# EAGLE design H2AR32 (EAGLE 9.6.2)

## Sheet 1 of 2
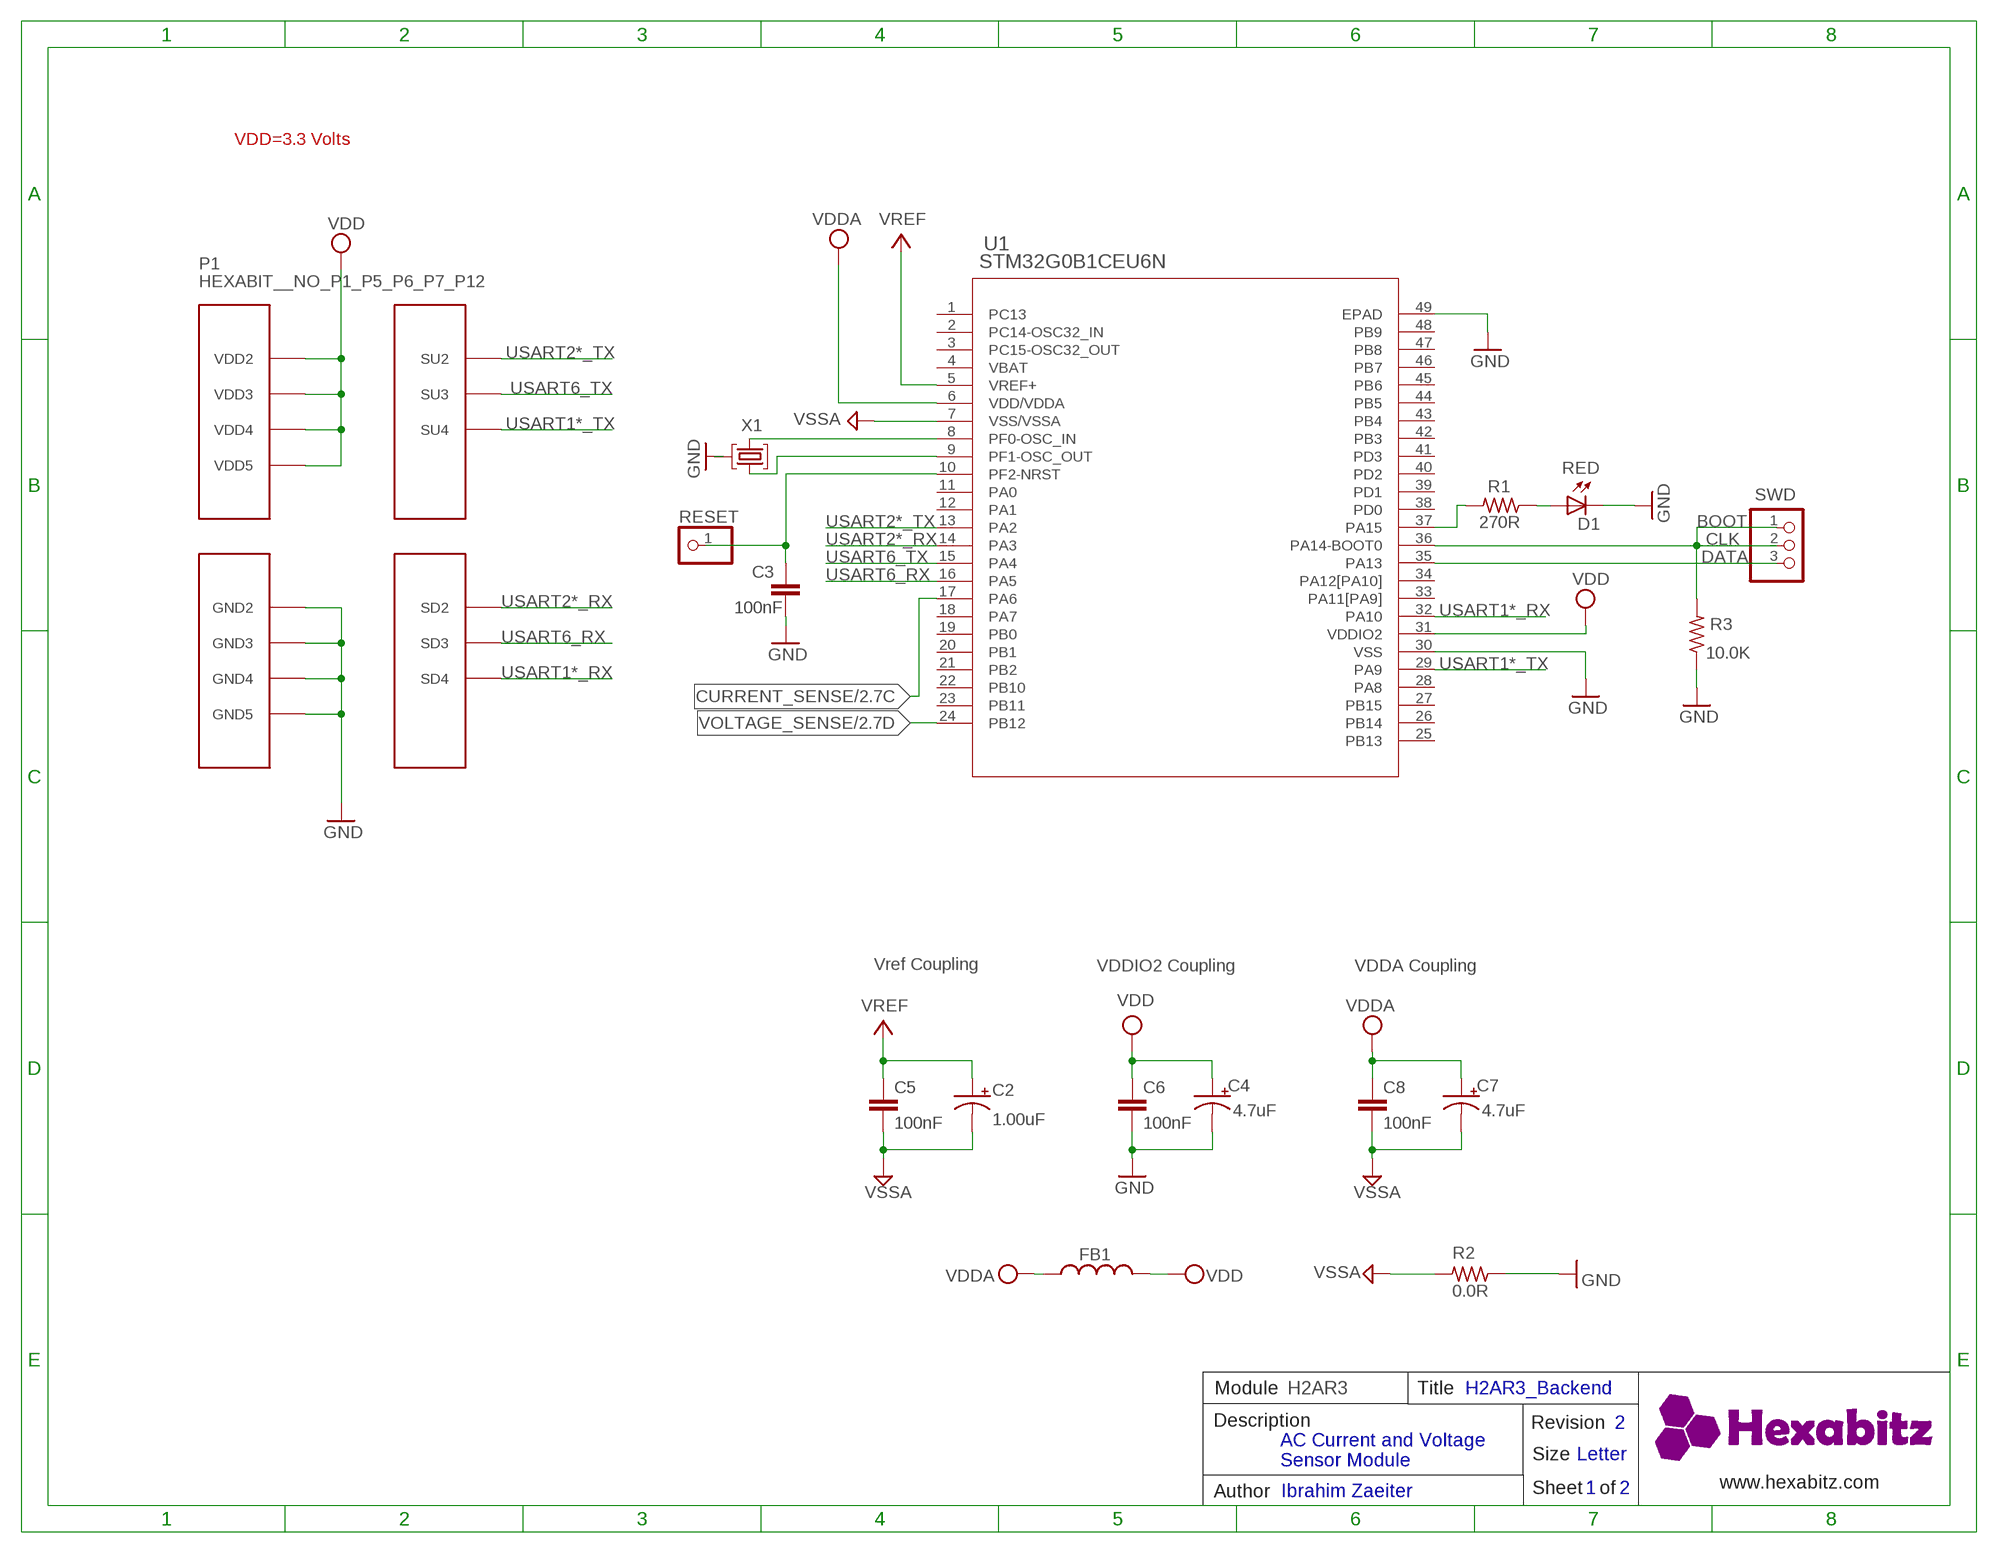
[diagram p0: schematic, sheet 1]

### Parts
C2  1.00uF  C-0805-POL  [C-0805-POL]
C3  100nF  C-0603  [C-0603]
C4  4.7uF  C-0805-POL  [C-0805-POL]
C5  100nF  C-0603  [C-0603]
C6  100nF  C-0603  [C-0603]
C7  4.7uF  C-0805-POL  [C-0805-POL]
C8  100nF  C-0603  [C-0603]
D1  RED  VLMS1300-GS08  [VLMS1300-GS08]
FB1  FB-TDK_MMZ1608Y300B  [FB-TDK_MMZ1608Y300B]
P1  HEXABIT__NO_P1_P5_P6_P7_P12  [HEXABIT_17.32_NO_P1_P6_P5_P7_P12]
R1  270R  R-0603  [R-0603]
R2  0.0R  R-0603  [R-0603]
R3  10.0K  R-0603  [R-0603]
RESET  R  PINHD-1X1  [1X01]
SWD  PINHD-1X3  [1X03]
U1  STM32G0B1CEU6N  [HEXABITZ_ICS_QFN_B1CEU6_STM-L]
X1  XTALL_CSTCE8M00G52  [XTALL_CSTCE8M00G52]

### Nets
CLK: R3.2 SWD.1 SWD.2 U1.36(PA14-BOOT0)
CURRENT_SENSE: U1.17(PA6) ; also sheet 2
DATA: SWD.3 U1.35(PA13)
GND: C3.2 C4.2(-) C6.2 D1.C P1.PAD_PD8(GND2) P1.PAD_PD9(GND3) P1.PAD_PD10(GND4) P1.PAD_PD11(GND5) R2.1 R3.1 U1.30(VSS) U1.49(EPAD) X1.P$2
N$1: R1.2 U1.37(PA15)
N$24: D1.A R1.1
N$25: U1.8(PF0-OSC_IN) X1.P$1
N$26: U1.9(PF1-OSC_OUT) X1.P$3
N$27: C3.1 RESET.1 U1.10(PF2-NRST)
USART1*_RX: P1.PAD_PD4(SD4) U1.32(PA10)
USART1*_TX: P1.PAD_PU4(SU4) U1.29(PA9)
USART2*_RX: P1.PAD_PD2(SD2) U1.14(PA3)
USART2*_TX: P1.PAD_PU2(SU2) U1.13(PA2)
USART6_RX: P1.PAD_PD3(SD3) U1.16(PA5)
USART6_TX: P1.PAD_PU3(SU3) U1.15(PA4)
VDD: C4.1(+) C6.1 FB1.2 P1.PAD_PU8(VDD2) P1.PAD_PU9(VDD3) P1.PAD_PU10(VDD4) P1.PAD_PU11(VDD5) U1.31(VDDIO2)
VDDA: C7.1(+) C8.1 FB1.1 U1.6(VDD/VDDA) ; also sheet 2
VOLTAGE_SENSE: U1.24(PB12) ; also sheet 2
VREF: C2.1(+) C5.1 U1.5(VREF+) ; also sheet 2
VSSA: C2.2(-) C5.2 C7.2(-) C8.2 R2.2 U1.7(VSS/VSSA) ; also sheet 2
Unconnected: U1.1(PC13) U1.2(PC14-OSC32_IN) U1.3(PC15-OSC32_OUT) U1.11(PA0) U1.12(PA1) U1.18(PA7) U1.19(PB0) U1.20(PB1) U1.21(PB2) U1.22(PB10) U1.23(PB11) U1.25(PB13) U1.26(PB14) U1.27(PB15) U1.28(PA8) U1.33(PA11[PA9]) U1.34(PA12[PA10]) U1.38(PD0) U1.39(PD1) U1.40(PD2) U1.41(PD3) U1.42(PB3) U1.43(PB4) U1.44(PB5) U1.45(PB6) U1.46(PB7) U1.47(PB8) U1.48(PB9)

### Notes on the sheet
- VDD=3.3 Volts
- BOOT
- Vref Coupling | VDDIO2 Coupling | VDDA Coupling
- Module | H2AR3 | Title | H2AR3_Backend
- Description | Revision | 2
- Size | Letter
- AC Current and Voltage 
  Sensor Module
- www.hexabitz.com
- Author | Ibrahim Zaeiter | Sheet   of | 1 | 2
- C:/Users/Admin/Desktop/logodraft.bmp

## Sheet 2 of 2
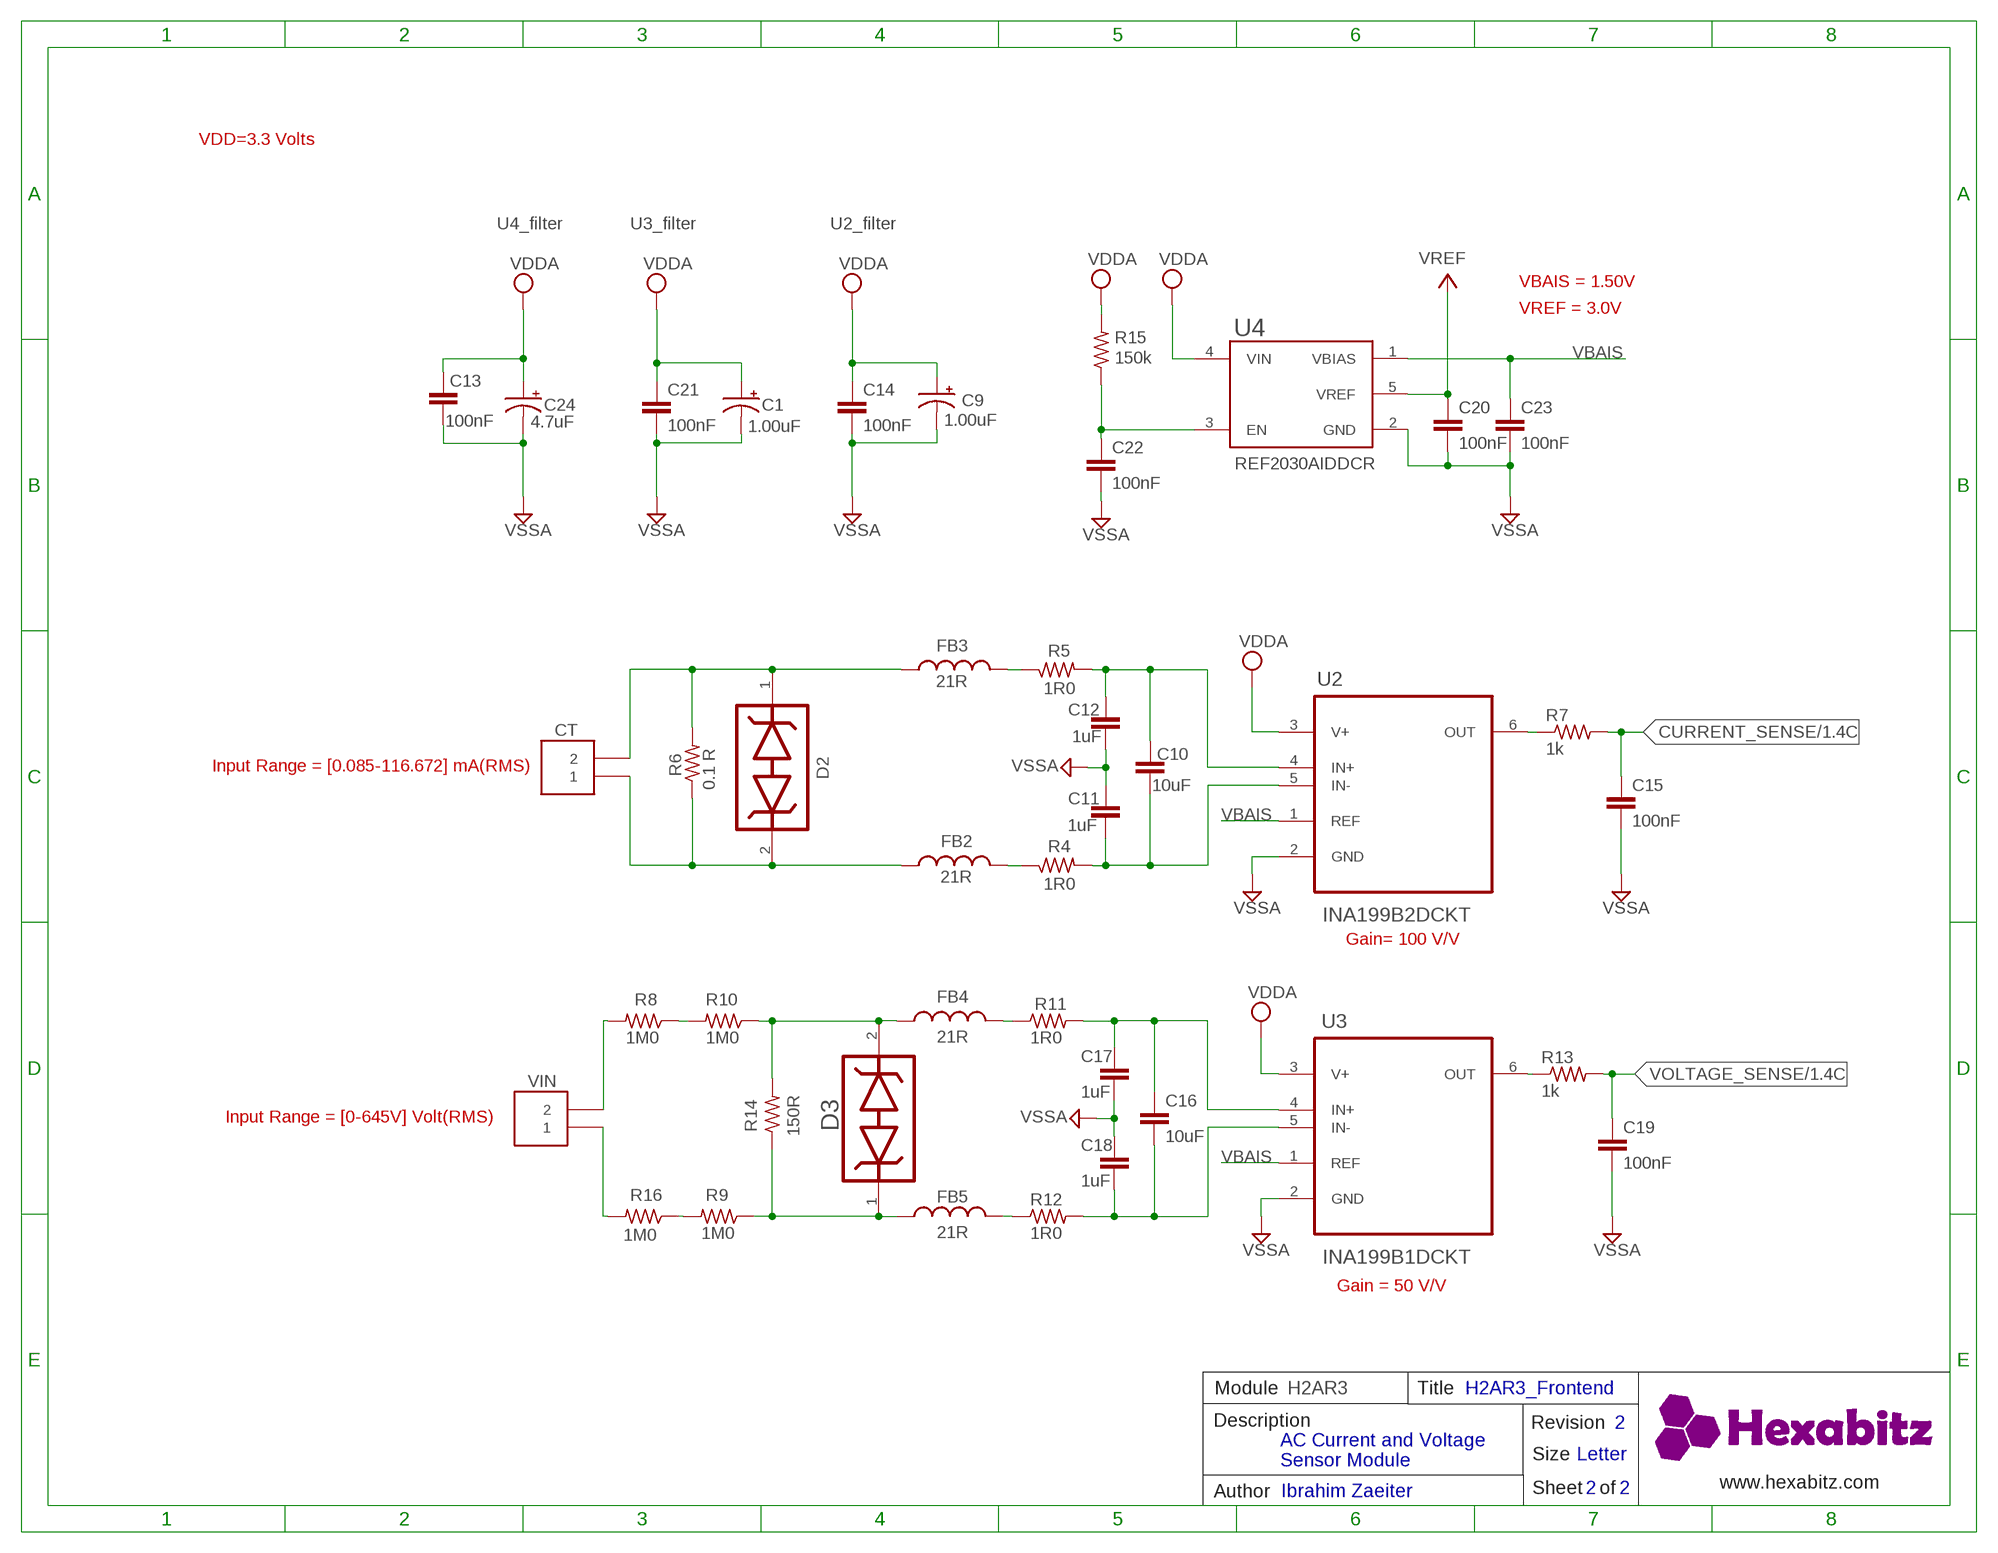
[diagram p1: schematic, sheet 2]

### Parts
C1  1.00uF  C-0805-POL  [C-0805-POL]
C9  1.00uF  C-0805-POL  [C-0805-POL]
C10  10uF  C-0603  [C-0603]
C11  1uF  C-0603  [C-0603]
C12  1uF  C-0603  [C-0603]
C13  100nF  C-0603  [C-0603]
C14  100nF  C-0603  [C-0603]
C15  100nF  C-0603  [C-0603]
C16  10uF  C-0603  [C-0603]
C17  1uF  C-0603  [C-0603]
C18  1uF  C-0603  [C-0603]
C19  100nF  C-0603  [C-0603]
C20  100nF  C-0603  [C-0603]
C21  100nF  C-0603  [C-0603]
C22  100nF  C-0603  [C-0603]
C23  100nF  C-0603  [C-0603]
C24  4.7uF  C-0805-POL  [C-0805-POL]
CT  1546111-2  [1546111-2]
D2  BOURNS_CDSOD323-T03SCBOURNS_CDSOD323-T03SC_0_0  [BOURNS_CDSOD323-T03SC_0]
D3  BOURNS_CDSOD323-T03SCBOURNS_CDSOD323-T03SC_0_0  [BOURNS_CDSOD323-T03SC_0]
FB2  21R  FB-0805  [FB-0805]
FB3  21R  FB-0805  [FB-0805]
FB4  21R  FB-0805  [FB-0805]
FB5  21R  FB-0805  [FB-0805]
R4  1R0  R-0603  [R-0603]
R5  1R0  R-0603  [R-0603]
R6  0.1 R  R-US_R2512  [R2512]
R7  1k  R-0603  [R-0603]
R8  1M0  R_1206R1206  [R1206]
R9  1M0  R_1206R1206  [R1206]
R10  1M0  R_1206R1206  [R1206]
R11  1R0  R-0603  [R-0603]
R12  1R0  R-0603  [R-0603]
R13  1k  R-0603  [R-0603]
R14  150R  R_1206R1206  [R1206]
R15  150k  R-0603  [R-0603]
R16  1M0  R_1206R1206  [R1206]
U2  INA199B2DCKT  [SOT65P210X110-6N]
U3  INA199B1DCKT  [SOT65P210X110-6N]
U4  TEXAS_INSTRUMENTS_REF2033AIDDCRTEXAS_INSTRUMENTS_REF2033AIDDCR_0_2  [TEXAS_INSTRUMENTS_REF2033AIDDCR_2]
VIN  1546111-2  [1546111-2]

### Nets
CT_3: CT.1 D2.2 FB2.2 R6.1
CT_4: CT.2 D2.1 FB3.2 R6.2
CURRENT_SENSE: C15.1 R7.2 ; also sheet 1
N$2: C10.1 C11.2 R4.2 U2.5(IN-)
N$6: FB2.1 R4.1
N$8: C10.2 C12.1 R5.2 U2.4(IN+)
N$9: FB3.1 R5.1
N$10: R9.2 R16.1
N$12: R8.2 VIN.2
N$13: R8.1 R10.2
N$14: R16.2 VIN.1
N$15: R7.1 U2.6(OUT)
N$16: C22.1 R15.1 U4.3(EN)
N$17: C16.1 C17.2 R11.2 U3.4(IN+)
N$18: C16.2 C18.1 R12.2 U3.5(IN-)
N$19: FB4.2 R11.1
N$20: FB5.2 R12.1
N$21: D3.2 FB4.1 R10.1 R14.2
N$22: D3.1 FB5.1 R9.1 R14.1
N$23: R13.1 U3.6(OUT)
VBAIS: C23.1 U2.1(REF) U3.1(REF) U4.1(VBIAS)
VDDA: C1.1(+) C9.1(+) C13.1 C14.1 C21.1 C24.1(+) R15.2 U2.3(V+) U3.3(V+) U4.4(VIN) ; also sheet 1
VOLTAGE_SENSE: C19.1 R13.2 ; also sheet 1
VREF: C20.1 U4.5(VREF) ; also sheet 1
VSSA: C1.2(-) C9.2(-) C11.1 C12.2 C13.2 C14.2 C15.2 C17.1 C18.2 C19.2 C20.2 C21.2 C22.2 C23.2 C24.2(-) U2.2(GND) U3.2(GND) U4.2(GND) ; also sheet 1

### Notes on the sheet
- VDD=3.3 Volts
- U4_filter | U3_filter | U2_filter
- VBAIS = 1.50V
- VREF = 3.0V
- Input Range = [0.085-116.672] mA(RMS)
- Gain= 100 V/V
- Input Range = [0-645V] Volt(RMS)
- Gain = 50 V/V
- Module | H2AR3 | Title | H2AR3_Frontend
- Description | Revision | 2
- Size | Letter
- AC Current and Voltage 
  Sensor Module
- www.hexabitz.com
- Author | Ibrahim Zaeiter | Sheet   of | 2 | 2

## Power pins joined to a net without a drawn wire
VBAT: U1.4(VBAT)

## Library data of the parts
C1 C2 C9 = HEXABITZ_RCLS:C-0805-POL: Cap Tant Solid SMD 2012; CAPACITANCE: 1.00uF; MFN: Yageo; MPN: CC0805KKX7R7BB105; OCTOPART_URL: https://octopart.com/cc0805kkx7r7bb105-yageo-8376555?r=sp&s=YKl1wwtkROau_X5nniH2ig; TOLERANCE: 10%; VOLTAGE_RATING: 16V
C3 C5 C6 C13-C15 C19-C23 = HEXABITZ_RCLS:C-0603: CAP CER 10% X7R 0603; CAPACITANCE: 100nF; MFN: KEMET; MPN: C0603C104K8RACTU; OCTOPART_URL: https://octopart.com/c0603c104k8ractu-kemet-145075?r=sp&s=9bS9ASSwSEqMCE9KBEQZ0g; TOLERANCE: 10%; VOLTAGE_RATING: 10V
C4 C7 C24 = HEXABITZ_RCLS:C-0805-POL: Cap Tant Solid SMD 2012; CAPACITANCE: 4.7uF; MFN: Murata; MPN: GRM21BC81E475KA12L; OCTOPART_URL: https://octopart.com/grm21bc81e475ka12l-murata-10331911?r=sp&s=RY3qZSD8T6mG6TC9CHI5qQ; TOLERANCE: 10%; VOLTAGE_RATING: 25V
C8 = HEXABITZ_RCLS:C-0603: CAP CER 10% X7R 0603; CAPACITANCE: 100nF; MFN: KEMET; MPN: C0603C104K8RACTU; OCTOPART_URL: https://octopart.com/c0603c104k8ractu-kemet-145075?r=sp&s=9bS9ASSwSEqMCE9KBEQZ0g; TOLERANCE: 10%; VOLTAGE_RATING: 10
C10 = HEXABITZ_RCLS:C-0603: CAP CER 10% X7R 0603; CAPACITANCE: 10uF; MFN: KEMET; MPN: C0603C106M9PACTU; OCTOPART_URL: https://octopart.com/c0603c106m9pactu-kemet-8375727?r=sp; VOLTAGE_RATING: 6.3v
C11 C12 C17 C18 = HEXABITZ_RCLS:C-0603: CAP CER 10% X7R 0603; CAPACITANCE: 1uF; MFN: KEMET; MPN: C0603C105K8RACTU; OCTOPART_URL: https://octopart.com/c0603c105k8ractu-kemet-12595642?r=sp; TOLERANCE: 10%; VOLTAGE_RATING: 10v
C16 = HEXABITZ_RCLS:C-0603: CAP CER 10% X7R 0603; CAPACITANCE: 10uF; MFN: KEMET; MPN: C0603C106M9PACTU; OCTOPART_URL: https://octopart.com/c0603c106m9pactu-kemet-8375727?r=sp; TOLERANCE: 20%; VOLTAGE_RATING: 6.3V
CT VIN = HEXABITZ_CONNECTION_PARTS:1546111-2: Conn Shrouded Header HDR 2 POS 5.08mm Solder ST Thru-Hole; MFN: TE Connectivity; MPN: 1546111-2; OCTOPART_URL: https://octopart.com/1546111-2-te+connectivity-40393355
D1 = HEXABITZ_USER_INTERFACE_PARTS:VLMS1300-GS08: Red 0603 130° Clear 54 mcd 2 V Surface Mount ChipLED ; Octopart Url : http://octopart.com/vlms1300-gs08-vishay-21709201; MFN: Vishay; MPN: VLMS1300-GS08; OCTOPART_URL: https://octopart.com/vlms1300-gs08-vishay-21709201?r=sp&s=_gcP4_q8T1SC6PJQPTQ9yA
D2 D3 = HEXABITZ_RCLS:BOURNS_CDSOD323-T03SC: CDSOD323-TxxSC - TVS Diode Series; DESCRIPTION: Dio Tvs Vwm 03V 500W Bidir Sod323 / Tape & Reel - 7" Reel; MFN: Bourns; MPN: CDSOD323-T03SC; OCTOPART_URL: https://octopart.com/cdsod323-t03sc-bourns-10487153?r=sp
FB1 = HEXABITZ_RCLS:FB-TDK_MMZ1608Y300B: Ferrite Beads Multi-Layer 30Ohm 25% 100MHz 1.5A 50mOhm DCR 0603; MFN: TDK; MPN: MMZ1608Y300B; OCTOPART_URL: https://octopart.com/mmz1608y300b-tdk-368280?r=sp&s=cd9_2ZEqQ9q9UNBuQgHAiA
FB2-FB5 = HEXABITZ_RCLS:FB-0805: Ferrite Beads Multi-Layer 0805; MFN: Taiyo Yuden; MPN: FBMJ2125HM210NT; OCTOPART_URL: https://octopart.com/fbmj2125hm210nt-taiyo+yuden-368424?r=sp
P1 = hexabitz_connectors:HEXABIT_?_NO_P1_P5_P6_P7_P12: Hexabitz Hexagon Module Connector Hexagon side length = 18.00mm.
R1 = HEXABITZ_RCLS:R-0603: Thick Film Resistors - SMD 0603; MFN: Yageo; MPN: RC0603FR-07270RL; OCTOPART_URL: https://octopart.com/search?q=RC0603FR-07270RL&start=0; RESISTANCE: 270.0 Ohm; TOLERANCE: 5%
R2 = HEXABITZ_RCLS:R-0603: Thick Film Resistors - SMD 0603; MFN: Yageo; MPN: RC0603JR-070RL; OCTOPART_URL: https://octopart.com/rc0603jr-070rl-yageo-1241539?r=sp&s=X2NteqRjRNWrnx42Y0aliA; RESISTANCE: 0.0 Ohm
R3 = HEXABITZ_RCLS:R-0603: Thick Film Resistors - SMD 0603; MFN: Yageo; MPN: RC0603JR-0710KL; OCTOPART_URL: https://octopart.com/search?q=RC0603JR-0710KL&start=0; RESISTANCE: 10.0K Ohm; TOLERANCE: 5%
R4 R5 R11 R12 = HEXABITZ_RCLS:R-0603: Thick Film Resistors - SMD 0603; MFN: Vishay; MPN: CRCW06031R00FKEA; OCTOPART_URL: https://octopart.com/crcw06031r00fkea-vishay-39713722?r=sp&s=biXSlGylTBiwPOCcABx_kA; RESISTANCE: 1; TOLERANCE: 1%
R6 = HEXABITZ_RCLS:R-US_: RESISTOR, American symbol; SPICEPREFIX: R
R7 R13 = HEXABITZ_RCLS:R-0603: Thick Film Resistors - SMD 0603; MFN: Yageo; MPN: RC0603JR-071KL; OCTOPART_URL: https://octopart.com/rc0603jr-071kl-yageo-55402888?r=sp; RESISTANCE: 1K; TOLERANCE: 5%
R8-R10 R16 = HEXABITZ_RCLS:R_1206: RESISTOR, American symbol; MFN: Yageo; MPN: RT1206BRD071ML; OCTOPART_URL: https://octopart.com/rt1206brd071ml-yageo-1262221?r=sp
R14 = HEXABITZ_RCLS:R_1206: RESISTOR, American symbol; MFN: Panasonic; MPN: ERA-8AEB151V; OCTOPART_URL: https://octopart.com/era-8aeb151v-panasonic-55477439?r=sp
R15 = HEXABITZ_RCLS:R-0603: Thick Film Resistors - SMD 0603; MFN: Vishay; MPN: CRCW0603150KFKEA; OCTOPART_URL: https://octopart.com/crcw0603150kfkea-vishay-39455816?r=sp; RESISTANCE: 150K; TOLERANCE: 1%
RESET = HEXABITZ_USER_INTERFACE_PARTS:PINHD-1X1: PIN HEADER; MFN: TE Connectivity; MPN: 87227-1; OCTOPART_URL: https://octopart.com/87227-1-te+connectivity-39512052?r=sp
SWD = pinhead:PINHD-1X3: PIN HEADER
U1 = HEXABITZ_ICs:STM32G0B1CEU6N
U2 = HEXABITZ_ICs:INA199B2DCKT: CURRENT SHUNT MONITOR; DESCRIPTION: 26V, bi-directional current sense amplifier 6-SC70 -40 to 125; MFN: Texas Instruments; MPN: INA199B2DCKT; OCTOPART_URL: https://octopart.com/ina199b2dckt-texas+instruments-24258237?r=sp
U3 = HEXABITZ_ICs:INA199B1DCKT: CURRENT SHUNT MONITOR; DESCRIPTION: 26V, bi-directional current sense amplifier 6-SC70 -40 to 125; MFN: Texas Instruments; MPN: INA199B1DCKT; OCTOPART_URL: https://octopart.com/ina199b1dckt-texas+instruments-24258235?r=sp
U4 = HEXABITZ_ICs:TEXAS_INSTRUMENTS_REF2033AIDDCR: V-Ref Precision 3.3V 20mA 5-Pin TSOT-23 T/R; DESCRIPTION: Low-Drift, Low-Power, Dual-Output Vref and Vref/2 Voltage Reference 5-SOT-23-THIN -40 to 125; MFN: Texas Instruments; MPN: REF2030AIDDCR; OCTOPART_URL: https://octopart.com/ref2033aiddcr-texas+instruments-46921199?r=sp; OUTPUT_VOLTAGE: 1.65/3.3V
X1 = HEXABITZ_OTHER_PARTS:XTALL_CSTCE8M00G52: MURATA CSTCE8M00G52-R0 RESONATOR, SMD, 8MHZ ; Octopart Url : https://octopart.com/cstce8m00g52-r0-murata-7145559; MFN: Murata; MPN: CSTCE8M00G52Z-R0; OCTOPART_URL: https://octopart.com/cstce8m00g52z-r0-murata-17755941?r=sp&s=JDnNJnrHQhyS8Zk4ofFWXw

## Net classes
0 default: clearance 0.205 mm

## Board
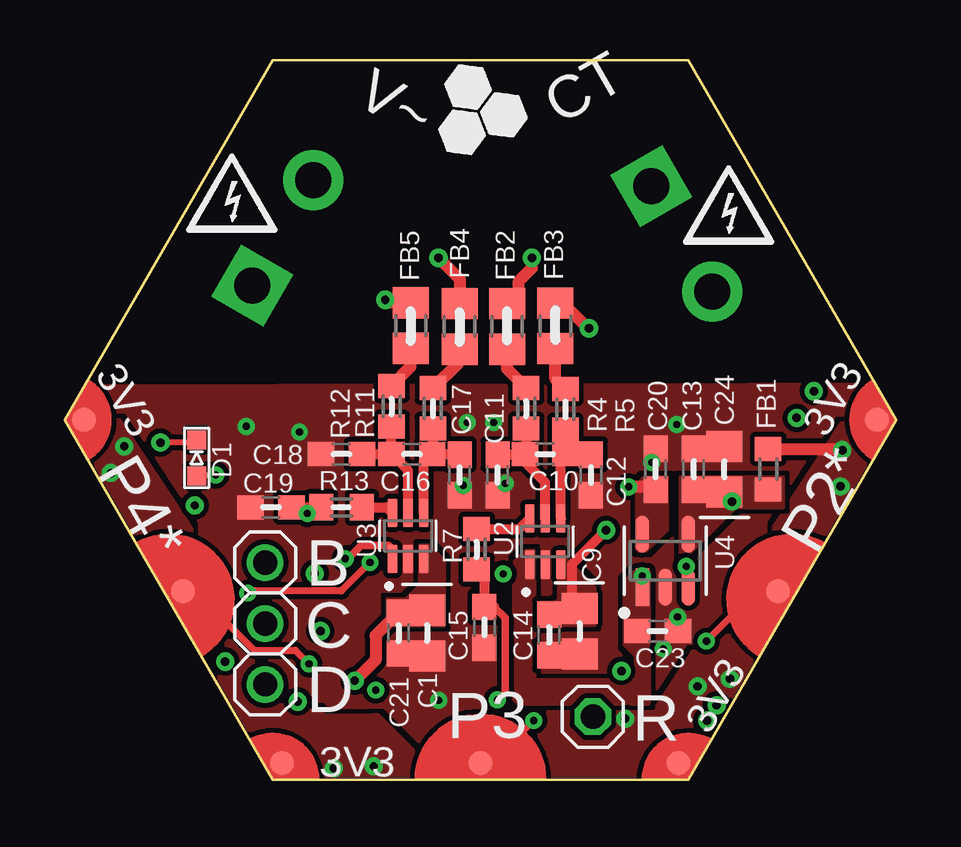
[diagram p2: board, top side]
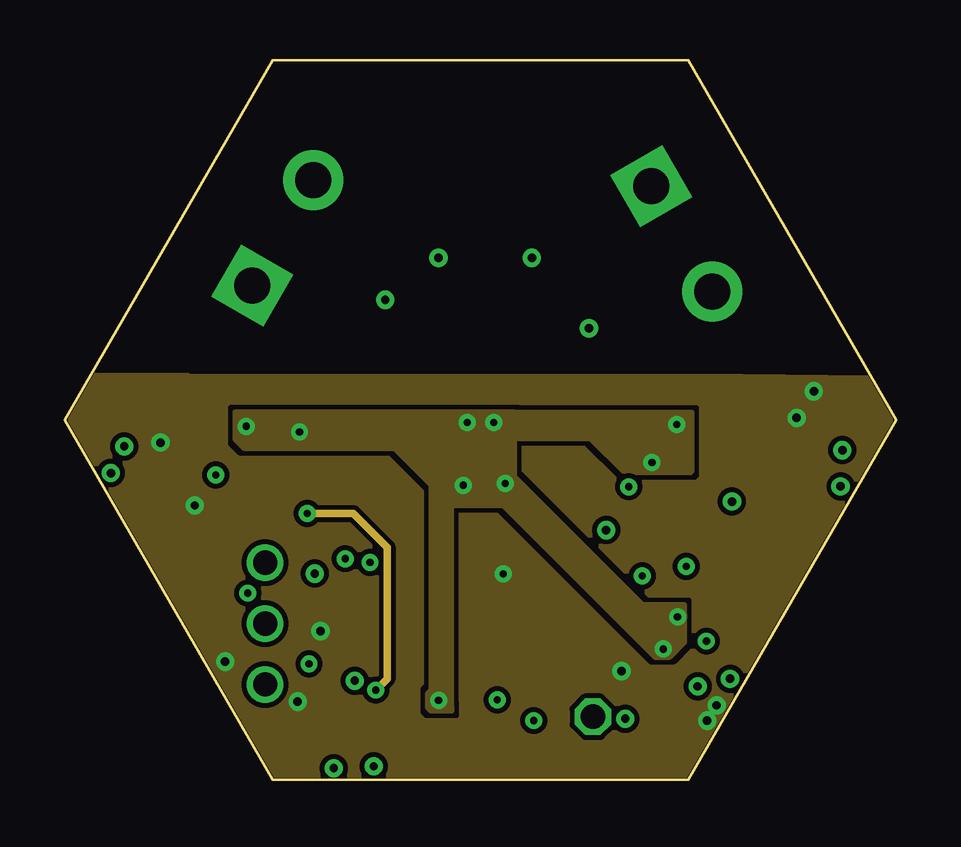
[diagram p3: board, inner layer Route2]
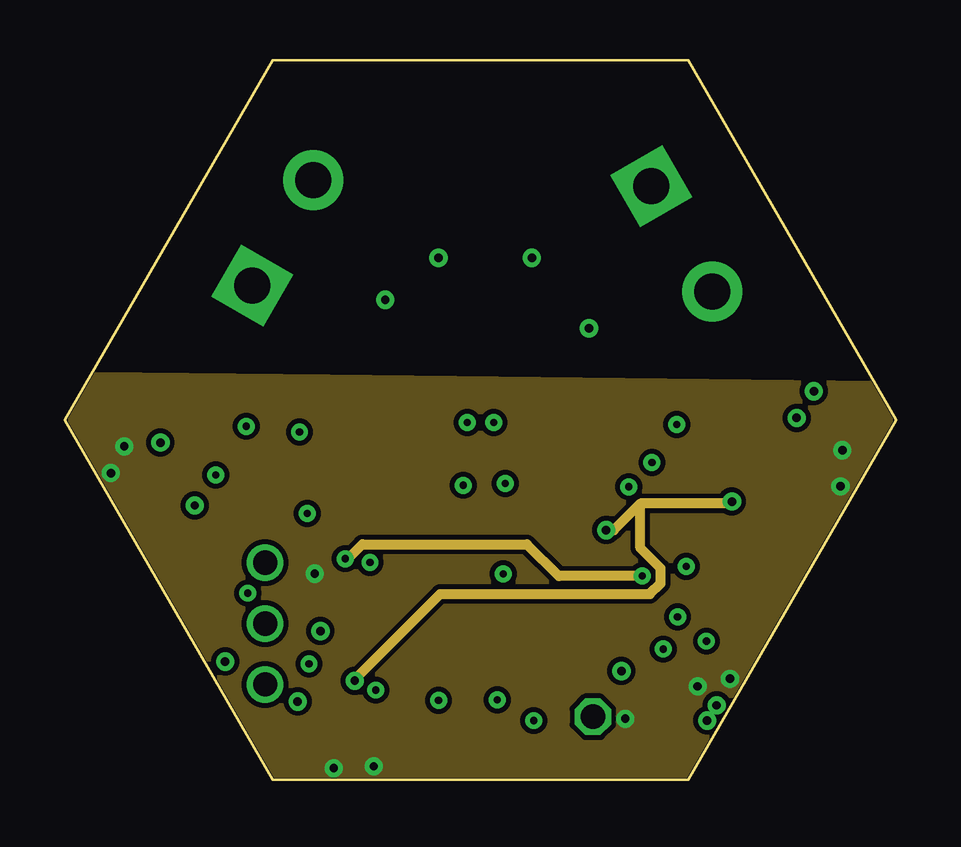
[diagram p4: board, inner layer Route15]
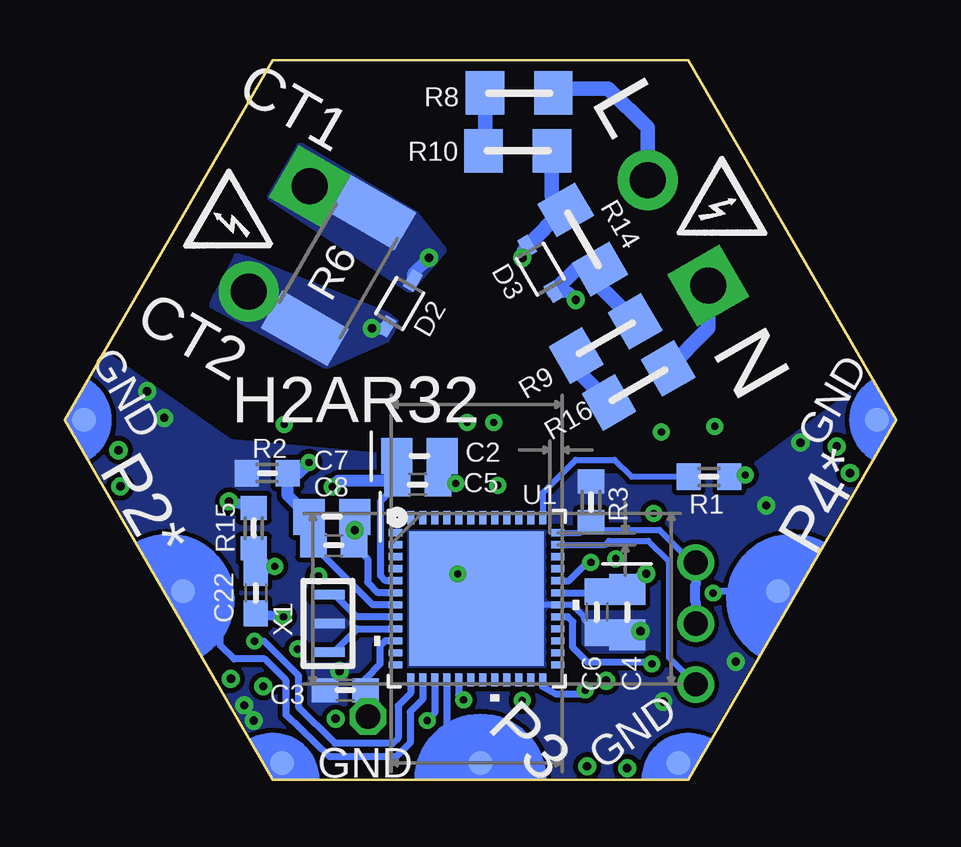
[diagram p5: board, bottom side, seen from below]

Size 34.64 x 30 mm. Coordinates in mm from the lower left corner, seen from the top.
Copper layers (1*2+15*16): Top 0.035mm / dielectric 0.175mm / Route2 0.035mm / dielectric 1.11mm / Route15 0.035mm / dielectric 0.175mm / Bottom 0.035mm
Design rules "4_layer *": minimum track width 7mil, minimum drill 10mil, track to track 6mil, track to pad 6mil, pad to pad 6mil, via to via 6mil, smd to smd 0mil, copper to edge 1mil, drill to drill 8mil, minimum pad ring 10mil, minimum via ring 8mil, stop-mask expansion 2mil, vias tented up to drill 15mil, thermal gap 10mil

### Footprints (pad centres in the part's own frame; a part is rotated, then mirrored left to right if it is on the bottom)
C-0805-POL = smd 1.3 x 1.5: 1 -0.95,0; 2 0.95,0
C-0603 = smd 1.1 x 1: 1 -0.85,0; 2 0.85,0
1546111-2 = drill 1.5 pad 2.5 square: 1 -2.54,0 | drill 1.5 pad 2.5: 2 2.54,0
VLMS1300-GS08 = smd 0.8 x 0.8: A 0,0.75; C 0,-0.75
BOURNS_CDSOD323-T03SC_0 = smd 0.8 x 0.5: 1 -1.1,0; 2 1.1,0
FB-TDK_MMZ1608Y300B = smd 1 x 1.1: 1 -0.85,0; 2 0.85,0
FB-0805 = smd 1.3 x 1.5: 1 -0.95,0; 2 0.95,0
HEXABIT_17.32_NO_P1_P6_P5_P7_P12 = smd 1 x 1 bottom: PAD_PD2 12.39,-7.15; PAD_PD3 0,-14.31; PAD_PD4 -12.39,-7.15; PAD_PD8 16.52,0; PAD_PD9 8.26,-14.31; PAD_PD10 -8.26,-14.31; PAD_PD11 -16.52,0 | smd 1 x 1: PAD_PU2 12.39,-7.15; PAD_PU3 0,-14.31; PAD_PU4 -12.39,-7.15; PAD_PU8 16.52,0; PAD_PU9 8.26,-14.31; PAD_PU10 -8.26,-14.31; PAD_PU11 -16.52,0
R-0603 = smd 1 x 1.1: 1 -0.85,0; 2 0.85,0
R2512 = smd 1.8 x 3.2: 1 -2.8,0; 2 2.8,0
R1206 = smd 1.6 x 1.803: 1 -1.422,0; 2 1.422,0
1X01 = drill 1.016 octagon: 1 0,0
1X03 = drill 1.016: 1 -2.54,0; 2 0,0; 3 2.54,0
HEXABITZ_ICS_QFN_B1CEU6_STM-L = smd 0.55 x 0.297: 1 -3.38,2.751; 2 -3.38,2.251; 3 -3.38,1.75; 4 -3.38,1.25; 5 -3.38,0.75; 6 -3.38,0.25; 7 -3.38,-0.25; 8 -3.38,-0.75; 9 -3.38,-1.25; 10 -3.38,-1.75; 11 -3.38,-2.251; 12 -3.38,-2.751; 25 3.38,-2.751; 26 3.38,-2.251; 27 3.38,-1.75; 28 3.38,-1.25; 29 3.38,-0.75; 30 3.38,-0.25; 31 3.38,0.25; 32 3.38,0.75; 33 3.38,1.25; 34 3.38,1.75; 35 3.38,2.251; 36 3.38,2.751 | smd 0.297 x 0.55: 13 -2.751,-3.38; 14 -2.251,-3.38; 15 -1.75,-3.38; 16 -1.25,-3.38; 17 -0.75,-3.38; 18 -0.25,-3.38; 19 0.25,-3.38; 20 0.75,-3.38; 21 1.25,-3.38; 22 1.75,-3.38; 23 2.251,-3.38; 24 2.751,-3.38; 37 2.751,3.38; 38 2.251,3.38; 39 1.75,3.38; 40 1.25,3.38; 41 0.75,3.38; 42 0.25,3.38; 43 -0.25,3.38; 44 -0.75,3.38; 45 -1.25,3.38; 46 -1.75,3.38; 47 -2.251,3.38; 48 -2.751,3.38 | smd 5.6 x 5.6: 49 0,0
SOT65P210X110-6N = smd 1.19 x 0.4: 1 -0.96,0.65; 2 -0.96,0; 3 -0.96,-0.65; 4 0.96,-0.65; 5 0.96,0; 6 0.96,0.65
TEXAS_INSTRUMENTS_REF2033AIDDCR_2 = smd 1.554 x 0.572: 1 -1.1,0.95; 2 -1.1,0; 3 -1.1,-0.95; 4 1.1,-0.95; 5 1.1,0.95
XTALL_CSTCE8M00G52 = smd 1.4 x 0.4: P$1 0,1.2; P$2 0,0; P$3 0,-1.2

### Placement (x,y rotation side)
C1  15.1,6.11 270 top
C2  19.86,13.49 0 bottom
C3  22.96,3.73 180 bottom
C4  11.21,6.98 270 bottom
C5  19.94,12.3 0 bottom
C6  12.48,6.98 270 bottom
C7  23.51,10.95 180 bottom
C8  23.43,9.76 180 bottom
C9  21.45,6.19 270 top
C10  20.02,13.57 0 top
C11  18.03,12.7 90 top
C12  21.92,12.7 270 top
C13  26.21,12.94 90 top
C14  20.18,6.03 270 top
C15  17.48,6.35 270 top
C16  14.46,13.57 180 top
C17  16.45,12.7 90 top
C18  11.53,13.57 180 top
C19  8.59,11.35 180 top
C20  24.62,12.94 90 top
C21  13.91,6.11 270 top
C22  26.69,7.78 270 bottom
C23  24.7,6.19 0 top
C24  27.48,12.94 90 top
CT  25.71,22.54 300 top
D1  5.49,13.41 180 top
D2  20.68,19.85 60 bottom
D3  14.83,21.29 120 bottom
FB1  29.31,12.94 90 top
FB2  18.43,18.89 90 top
FB3  20.44,18.92 90 top
FB4  16.45,18.89 270 top
FB5  14.42,18.93 270 top
P1  17.32,15 0 top
R1  7.8,12.62 180 bottom
R2  26.21,12.78 0 bottom
R3  12.72,11.59 270 bottom
R4  19.23,15.48 270 top
R5  20.86,15.44 270 top
R6  23.24,21.24 240 bottom
R7  17.16,9.6 270 top
R8  15.71,28.62 0 bottom
R9  12.11,18.39 210 bottom
R10  15.77,26.21 180 bottom
R11  15.34,15.48 270 top
R12  13.62,15.56 270 top
R13  11.53,11.35 180 top
R14  13.06,22.52 120 bottom
R15  26.77,10.48 90 bottom
R16  10.73,16.43 30 bottom
RESET  22,2.62 0 top
SWD  8.35,6.51 270 top
U1  17.48,7.54 0 bottom
U2  20.02,9.92 90 top
U3  14.3,10.16 90 top
U4  25.02,9.13 90 top
VIN  9.09,22.79 60 top
X1  23.67,6.51 0 bottom

### Tracks (layer width: path | path; a pad name or v marks a point on that pad's centre or on a via)
CLK
  Bottom 0.254: U1.36 13.16,10.29 R3.2 12.39,10.41 9.87,10.41 8.51,9.05 SWD.1
  Bottom 0.406: SWD.1 8.35,8.13 8.39,8.09 8.39,7.45 8.35,7.41 SWD.2
CT_3  (via drill 0.35)
  Top 0.508: FB2.2 18.92,20.33 18.92,20.79 19.46,21.33 v19.46,21.75
  Bottom 0.508: v19.46,21.75 20.13,21.08 D2.2
  pour Bottom (rank 6, no thermals): 24.86,26.43 26.13,24.29 20.26,20.4 18.83,22.06 20.02,23.57 24.78,26.43
CT_4  (via drill 0.35)
  Top 0.508: v21.84,18.81 21.81,18.81 20.75,19.87 FB3.2
  Bottom 0.508: v21.84,18.81 21.32,18.81 D2.1
  pour Bottom (rank 6, no thermals): 21.21,19.37 27,21.67 27.48,21.83 28.35,20.16 28.51,19.76 23.75,17.22 21.21,18.33 20.81,19.05
CURRENT_SENSE  (via drill 0.3 pad 0.55)
  Top 0.305: 17.88,7.2 18.34,6.73 18.34,3.64 v18.02,3.33
  Top 0.406: R7.2 17.48,8.43 C15.1 17.88,7.2
  Bottom 0.292: U1.17 18.23,3.53 v18.02,3.33
DATA
  Bottom 0.254: SWD.3 9.46,5.08 9.46,9.09 10.32,9.95 11.96,9.95 12.11,9.79 U1.35
GND  (via drill 0.3 pad 0.55, 0.35 pad 0.75)
  Top 0.254: D1.C 5.38,14.05 v3.98,14.05
  Bottom 0.254: C4.2 11.31,6.13 C6.2 12.99,6.65 12.99,6.78 13.5,7.29 U1.30 17.23,7.29 U1.49
  other vias: 5.41,11.43 9.7,3.25 6.68,4.92 27.16,3.09 26.77,2.46 31.21,16.19 30.5,15.08 10.65,6.19 23.19,4.52 18.27,8.57
  pour Bottom (rank 6, no thermals): 32.8,17.7 27.72,14.13 12.24,12.7 6.53,12.7 1.05,16.75 -1.65,13.02 -1.65,-0.56 30.26,-0.56 36.45,15.71 34.7,18.02 32.72,17.7
  pour Route2 (rank 2, no thermals): 0.02,15 8.59,0.08 25.89,0 34.62,15 33.56,16.72 28.25,16.78 5.16,16.78 5.12,16.83 1.22,16.82 0.1,15.08
N$1
  Bottom 0.254: R1.2 11.03,12.62 11.74,13.33 13.35,13.33 14.73,11.96 U1.37
N$2
  Top 0.406: U2.5 20.02,12.38 19.17,13.23 C10.1 | C11.2 19.15,13.55 C10.1 | R4.2 19.23,13.63 C10.1
N$6
  Top 0.508: R4.1 18.43,17.12 FB2.1
N$8
  Top 0.406: U2.4 20.67,13.37 C10.2 20.86,13.58 20.86,13.65 | 20.86,13.65 R5.2 | C12.1 21.82,13.65 20.86,13.65
N$9
  Top 0.508: R5.1 20.44,16.7 FB3.1
N$10
  Bottom 0.61: R9.2 13.34,17.09 R16.1
N$12
  Bottom 0.61: VIN.2 10.36,27.17 12,28.81 14.1,28.81 R8.2
N$13
  Bottom 0.61: R8.1 17.13,26.27 R10.2
N$14
  Bottom 0.61: VIN.1 7.82,18.82 R16.2
N$15
  Top 0.406: R7.1 18.94,10.45 U2.6
N$16  (via drill 0.3 pad 0.55)
  Top 0.406: U4.3 v25.89,8.89
  Bottom 0.406: v25.89,8.89 C22.1 R15.1
N$17
  Top 0.406: U3.4 14.95,13.21 C16.1 | C17.2 15.34,13.55 C16.1 | R11.2 15.34,13.59 C16.1
N$18
  Top 0.406: C16.2 R12.2 | C18.1 C16.2 | U3.5 14.3,12.88 C16.2
N$19
  Top 0.508: R11.1 16.45,17.44 FB4.2
N$20
  Top 0.508: R12.1 14.42,17.21 FB5.2
N$21  (via drill 0.35 pad 0.75)
  Top 0.508: v15.57,21.75 16.45,20.87 FB4.1
  Bottom 0.508: D3.2 15.57,22.05 v15.57,21.75
  Bottom 0.61: D3.2 13.87,23.75 R14.2 14.35,24.33 R10.1
N$22  (via drill 0.35 pad 0.75)
  Top 0.508: FB5.1 13.47,19.88 v13.35,20
  Bottom 0.508: D3.1 13.69,20.34 v13.35,20
  Bottom 0.61: R9.1 12.34,20.57 R14.1 13.33,21.29 D3.1
N$23
  Top 0.406: R13.1 13.42,11.35 U3.6
N$24  (via drill 0.3 pad 0.55)
  Top 0.254: D1.A 5.53,12.7 v6.29,12.7
  Bottom 0.254: v6.29,12.7 6.87,12.7 R1.1
N$25
  Bottom 0.292: X1.P$1 23.4,7.71 22.48,6.79 U1.8
N$26
  Bottom 0.292: U1.9 22.46,6.29 23.44,5.31 X1.P$3
N$27
  Bottom 0.292: U1.10 21.28,5.79 21.51,5.56 21.51,4.8 22.11,4.2 C3.1 22,3.63 RESET.1
USART1*_RX  (via drill 0.3 pad 0.55)
  Top 0.292: v7.63,7.77 7.72,7.86 11.53,7.86 v12.72,9.05
  Bottom 0.292: U1.32 13.63,8.29 12.87,9.05 v12.72,9.05 | v7.63,7.77 7.55,7.85 P1.PAD_PD4
USART1*_TX  (via drill 0.3 pad 0.55)
  Top 0.292: v10.18,4.82 9.61,5.39 7.89,5.39 5.43,7.85 P1.PAD_PU4
  Bottom 0.292: v10.18,4.82 10.26,4.9 12.88,4.9 13.47,5.5 13.47,6.58 13.68,6.79 U1.29
USART2*_RX
  Bottom 0.292: U1.14 | U1.14 19.73,3.34 20.26,2.82 20.26,1.52 20.83,0.95 23.6,0.95 25.42,2.7 25.42,4.13 26.31,5.02 27.58,5.02 28.15,5.59 28.15,6.29 P1.PAD_PD2
USART2*_TX  (via drill 0.3 pad 0.55)
  Top 0.292: v26.74,5.77 28.82,7.85 P1.PAD_PU2
  Bottom 0.292: U1.13 20.23,3.6 20.75,3.08 20.75,1.73 20.98,1.5 23.38,1.5 24.91,3.04 24.91,4.34 26.34,5.77 v26.74,5.77
USART6_RX
  Bottom 0.292: U1.16 18.73,2.1
  Bottom 0.3: 18.73,2.1 P1.PAD_PD3
USART6_TX  (via drill 0.3 pad 0.55)
  Top 0.292: v19.54,2.46 17.77,0.69
  Top 0.305: 17.77,0.69 P1.PAD_PU3
  Bottom 0.292: U1.15 19.23,2.77 v19.54,2.46
VBAIS  (via drill 0.3 pad 0.55)
  Top 0.305: v11.68,9.21 11.79,9.21 12.34,9.76 13.49,9.76 13.65,9.6 U3.1
  Route15 0.406: v11.68,9.21 11.8,9.21 12.4,9.81 19.26,9.81 20.58,8.48 v24.06,8.48 v24.07,8.49
  pour Top (no thermals): 24.3,8.65 24.3,3.17 18.91,3.17 18.75,3.33 18.75,9.05 19.23,9.52 19.54,9.52 19.54,4.13 23.75,4.13 23.83,4.21 23.83,5.16 23.35,5.63 23.35,8.25 23.75,8.65
VDD  (via drill 0.35 pad 0.75)
  Top 0.508: FB1.2 32.34,13.79 v32.4,13.73
  Bottom 0.254: C6.1 11.31,7.83 C4.1
  Bottom 0.292: U1.31 12.52,7.79 C6.1
  Bottom 0.406: C4.1 10.56,8.59 v10.41,8.59
  other vias: 1.92,12.78 2.48,13.89 11.21,0.47 12.88,0.55 26.37,3.89 32.32,12.22 23.35,2.54 27.72,4.21
  pour Route15 (rank 4, no thermals): 0.02,15 8.59,0.08 25.89,0 34.7,15.12 33.85,16.5 11.03,16.75 1.25,16.86 0.1,15.08
  pour Top (rank 2, no thermals): 0.02,15 8.59,0.08 25.89,0 34.62,15 33.59,16.67 24.54,2.78 17.91,3.04 17.08,2.22 14.54,1.13 13.02,2.65 12.7,2.62 10.81,2.62 10.49,2.94 10.34,2.78 1.13,16.67 0.1,15.08
VDDA  (via drill 0.35 pad 0.75)
  Top 0.406: v22.56,10.4 21.13,8.97 21.13,7.06
  Top 0.508: v12.08,4.12 12.95,4.99 12.95,6 C21.1 | C9.1 21.37,7.06 21.29,7.06 21.13,7.06
  Route15 0.406: v27.8,11.59 27.72,11.51 23.99,11.51 | 23.99,11.51 22.88,10.4 v22.56,10.4 | v12.08,4.12 12.08,4.17 15.64,7.73 24.38,7.73 24.83,8.18 24.83,8.81 23.99,9.65 23.99,11.51
  Bottom 0.292: C8.1 22.03,9.21 22.03,8.22 21.6,7.79 U1.6
  Bottom 0.406: R15.2 v27.8,11.59
  Bottom 0.508: C7.1 22.56,9.78 C8.1 22.56,9.78 v22.56,10.4
  pour Top (rank 2, no thermals): 20.57,9.44 20.57,7.54 20.42,7.38 19.7,7.38 19.7,6.43 22.08,6.43 22.08,8.02 20.65,9.44
  pour Top (rank 2, no thermals): 15.81,6.43 15.81,9.13 15.18,9.76 14.78,9.76 14.78,8.09 14.22,7.54 13.43,7.54 13.43,6.51 13.51,6.43
  pour Top (no thermals): 25.65,9.44 25.65,12.62 29.94,12.62 29.94,11.35 27.96,11.35 26.05,9.44
VOLTAGE_SENSE  (via drill 0.3 pad 0.55)
  Top 0.292: v10.1,11.09 10.35,11.35 R13.2
  Top 0.406: R13.2 C19.1
  Route2 0.305: v10.1,11.09 12.02,11.09 13.43,9.68 13.43,4.21 v12.95,3.73
  Bottom 0.292: U1.24 14.73,3.88 14.18,3.57 13.11,3.57 v12.95,3.73
VREF  (via drill 0.3 pad 0.55)
  Top 0.508: C20.1 24.5,12.21 v23.5,12.21
  Bottom 0.292: U1.5 21.28,8.29 21.48,8.5 21.48,11.61 C5.1 20.81,12.32 20.81,12.46 C2.1
  Bottom 0.508: v23.5,12.21 23.24,12.46 20.81,12.46
  pour Top (rank 2, no thermals): 25.1,12.62 24.15,12.62 23.83,12.3 23.83,9.6 23.91,9.52 24.23,9.52 25.1,10.4 25.1,11.51
VSSA  (via drill 0.3 pad 0.55)
  Top 0.406: v25.53,6.78 C23.2
  Bottom 0.292: U1.7 21.82,7.29 C8.2 24.28,10.77 C7.2
  Bottom 0.406: C22.2 v25.53,6.78
  Bottom 0.508: C7.2 25.36,11.85 R2.2 24.91,12.78 v24.46,13.22 | C2.2 19.09,13.31 C5.2 18.4,12.3 v18.35,12.35
  other vias: 9.78,14.49 25.5,14.81 16.76,14.89 17.88,14.89 24.94,5.44 15.57,3.3 7.56,14.73 16.61,12.27
  pour Top (rank 6, no thermals): -0.94,16.43 38.28,16.51 38.43,-0.24 -0.38,-0.32
  pour Route2: 7.08,15.32 7.08,14.21 7.48,13.81 13.75,13.81 16.13,11.43 18.75,11.43 18.75,15.32
  pour Route2: 24.07,7.3 25.81,7.3 25.81,5.71 25.18,5.08 24.62,5.08 17.56,12.14 18.39,12.98
  pour Route2: 18.35,15.32 26.13,15.32 26.13,12.86 26.05,12.78 23.35,12.78 21.92,14.21 18.35,14.21
  pour Route2: 16.13,3.01 16.13,12.62 15.26,12.62 15.26,3.73 15.1,3.57 15.1,3.01 15.26,2.86 16.13,2.86 16.13,2.94

### Text on the board
tPlace: V~ | CT | 3V3 | 3V3 | P2* | P4* | P3 | 3V3 | 3V3
bPlace: L | CT1 | CT2 | N | GND | H2AR32 | GND | P4* | P2* | GND | P3 | GND
tNames: B | C | D | R